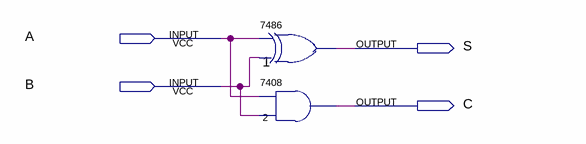
[diagram p0: schematic sheet]
// Quartus schematic Project.bdf as structural Verilog: 2 symbols, 4 pins
module Project (
  input  A,
  input  B,
  output S,
  output C
);

  \7486  u_1 (.\2 (A), .\3 (B), .\1 (S));
  \7408  u_2 (.\3 (B), .\2 (A), .\1 (C));
endmodule
